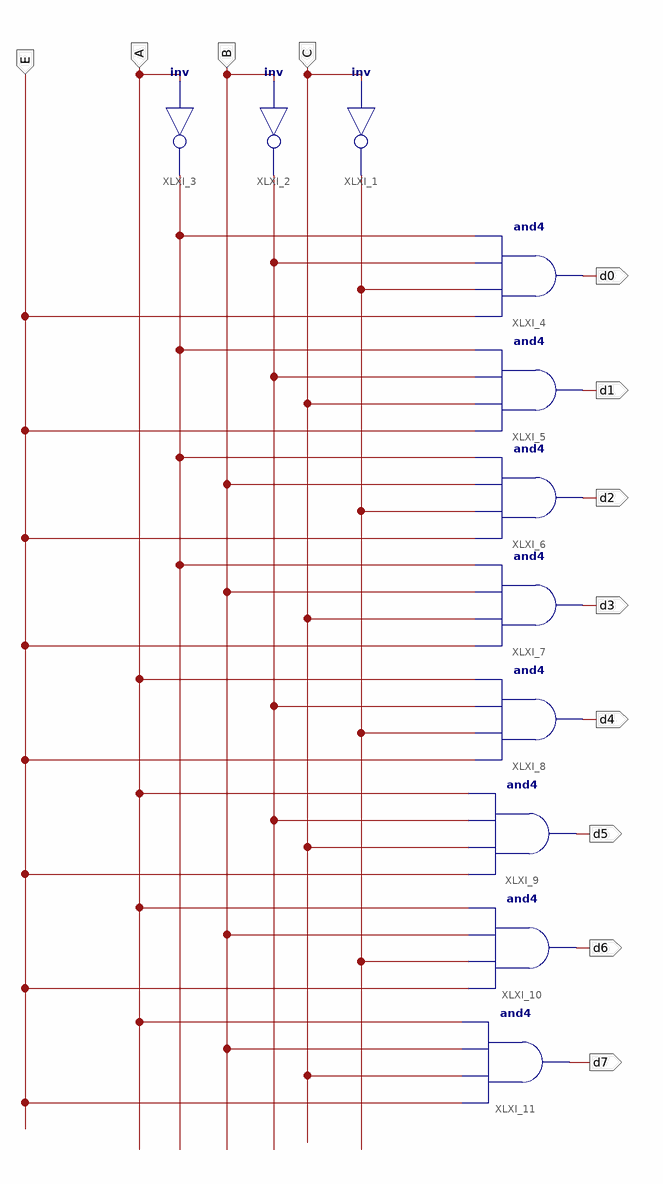
[diagram p0: schematic sheet 1]
// Xilinx ISE schematic sprinkler_circuit.sch (spartan3e) as structural Verilog: 11 symbols, 12 ports
module sprinkler_circuit (
  input  A,
  input  C,
  input  B,
  input  E,
  output d0,
  output d1,
  output d2,
  output d3,
  output d4,
  output d5,
  output d6,
  output d7
);

  wire XLXN_28, XLXN_29, XLXN_31;

  not XLXI_3 (XLXN_28, A);
  and XLXI_4 (d0, E, XLXN_31, XLXN_29, XLXN_28);
  and XLXI_5 (d1, E, C, XLXN_29, XLXN_28);
  and XLXI_6 (d2, E, XLXN_31, B, XLXN_28);
  and XLXI_7 (d3, E, C, B, XLXN_28);
  and XLXI_8 (d4, E, XLXN_31, XLXN_29, A);
  and XLXI_9 (d5, E, C, XLXN_29, A);
  and XLXI_10 (d6, E, XLXN_31, B, A);
  and XLXI_11 (d7, E, C, B, A);
  not XLXI_1 (XLXN_31, C);
  not XLXI_2 (XLXN_29, B);
endmodule
